# EAGLE design Fyre-BASIC-TOP (EAGLE 9.6.2)
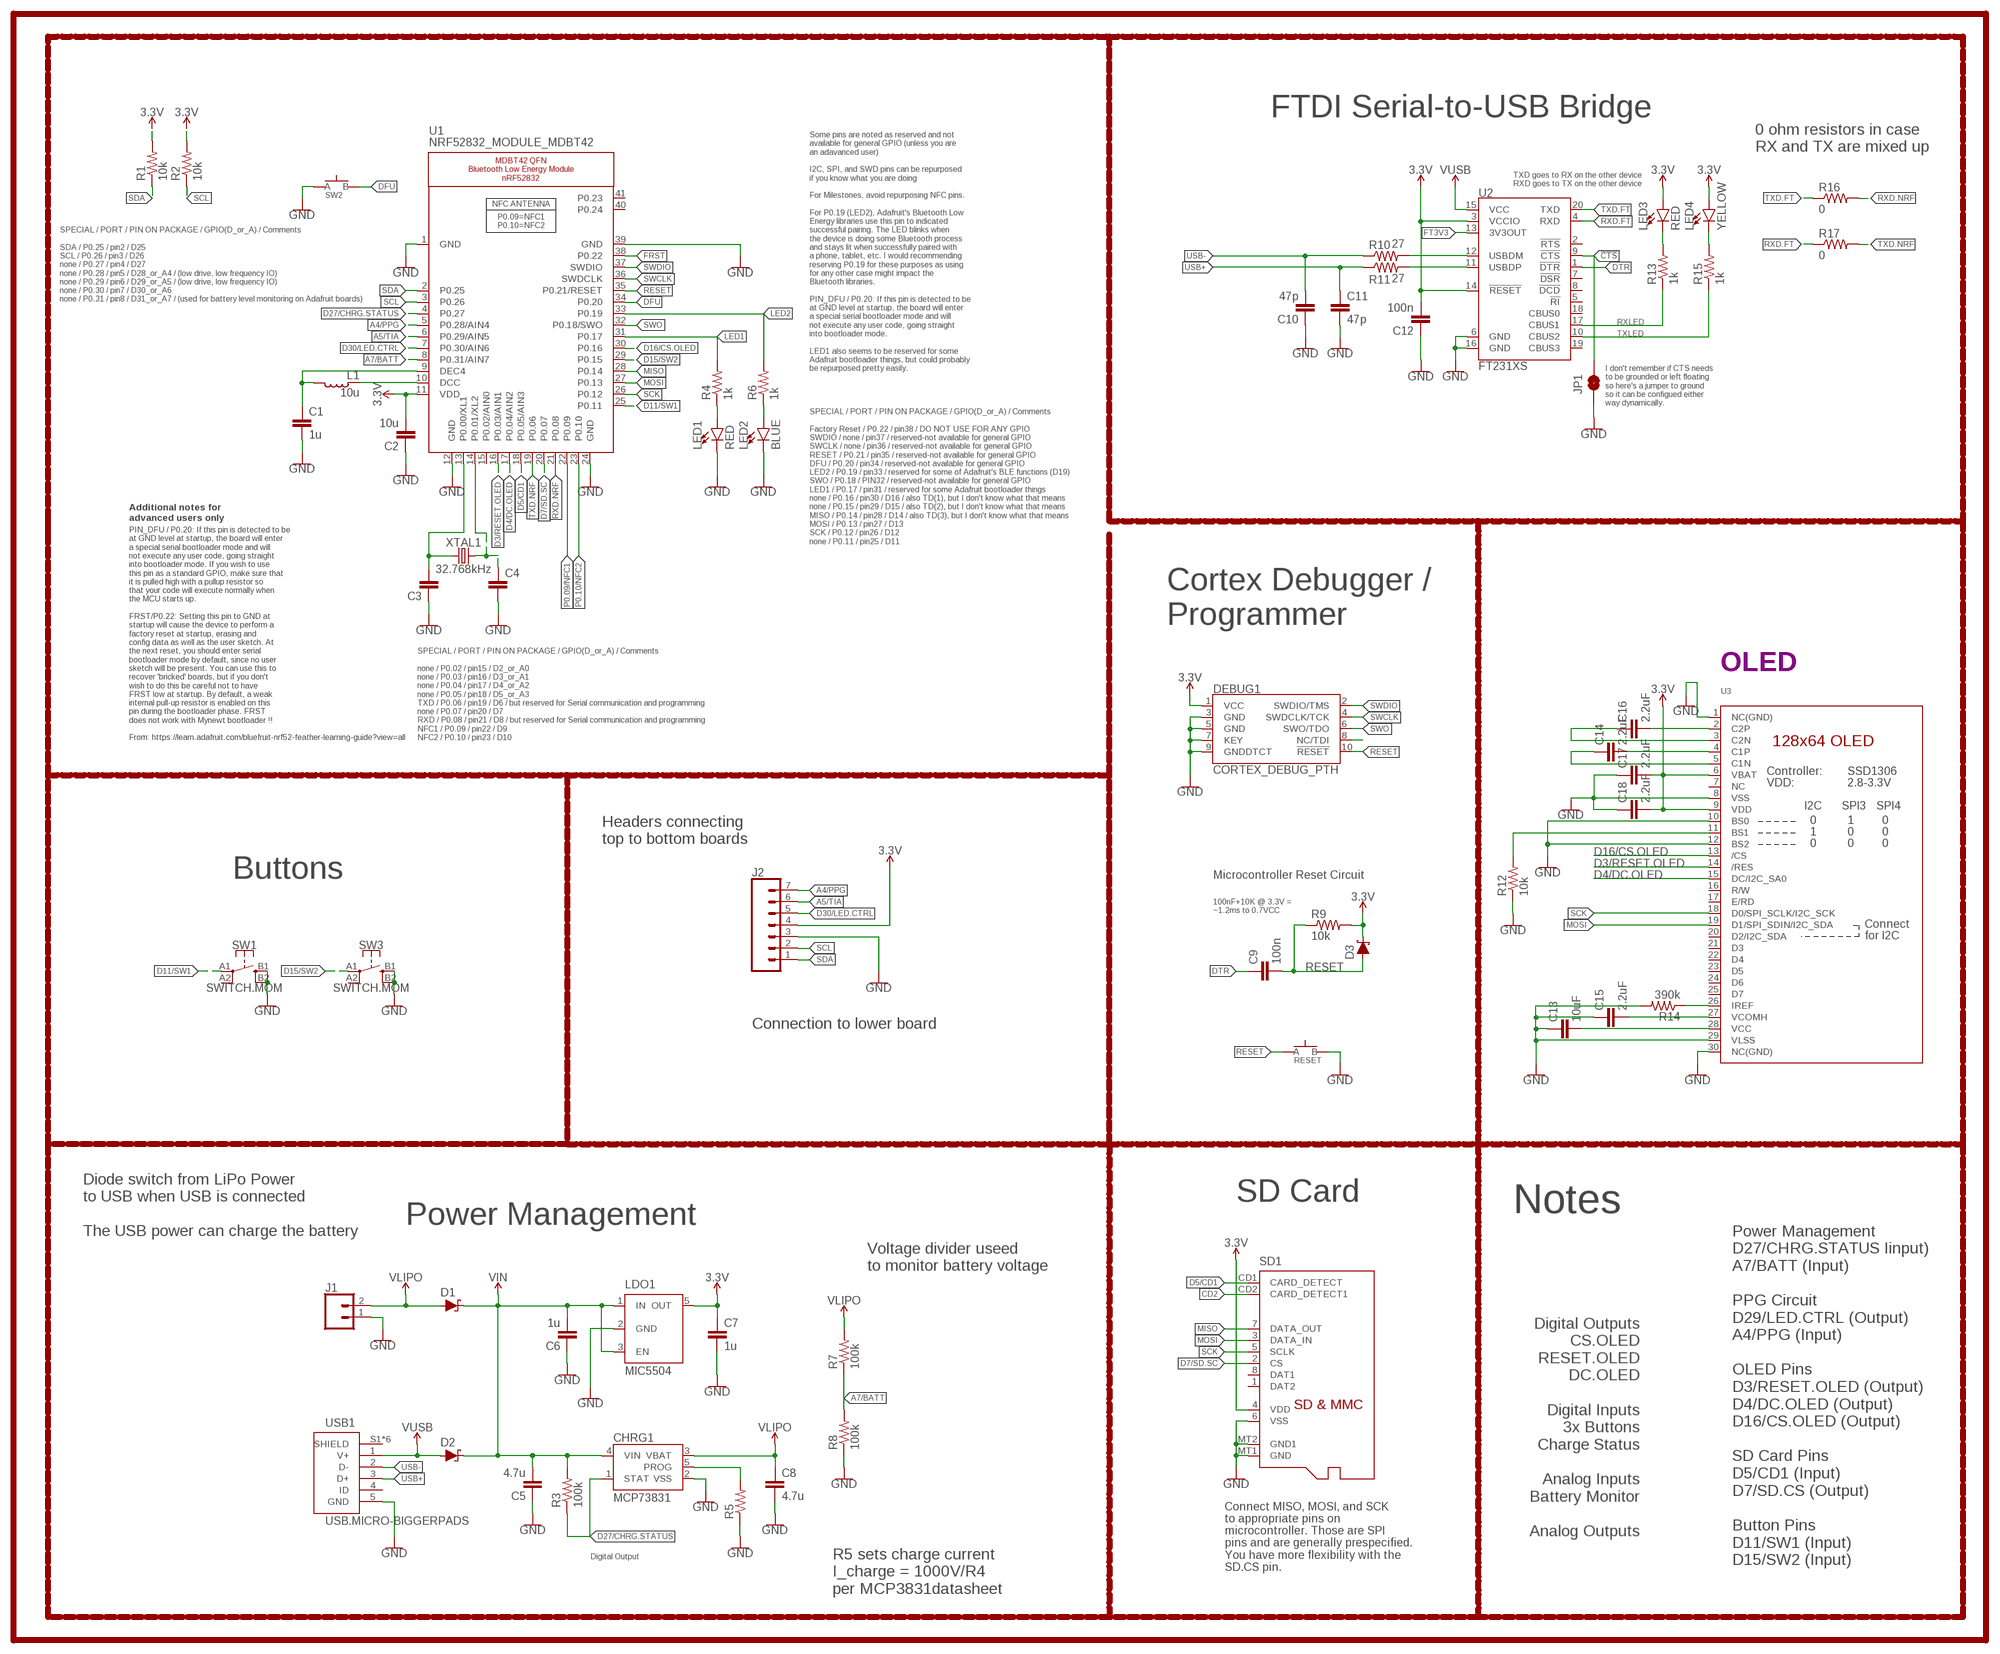
[diagram p0: schematic, sheet 1]

## Parts
C1  1u  CAPACITOR0603  [C0603]
C2  10u  CAPACITOR0805  [C0805]
C3  CAPACITOR0603  [C0603]
C4  CAPACITOR0603  [C0603]
C5  4.7u  CAPACITOR0603  [C0603]
C6  1u  CAPACITOR0603  [C0603]
C7  1u  CAPACITOR0603  [C0603]
C8  4.7u  CAPACITOR0603  [C0603]
C9  100n  CAPACITOR0603  [C0603]
C10  47p  CAPACITOR0603  [C0603]
C11  47p  CAPACITOR0603  [C0603]
C12  100n  CAPACITOR0603  [C0603]
C13  10uF  CAPACITOR0603  [C0603]
C14  2.2uF  CAPACITOR0402  [C0402]
C15  2.2uF  CAPACITOR0402  [C0402]
C16  2.2uF  CAPACITOR0402  [C0402]
C17  2.2uF  CAPACITOR0402  [C0402]
C18  2.2uF  CAPACITOR0402  [C0402]
CHRG1  MCP73831  [SOT23-5]
D1  SCHOTTKY-USC  [USC]
D2  SCHOTTKY-USC  [USC]
D3  SCHOTTKY-USC  [USC]
DEBUG1  CORTEX_DEBUG_PTH  [2X5-PTH-1.27MM]
J1  CONN_02  [1X02]
J2  CONN_07-1.27MM  [1X07_1.27MM]
JP1  JUMPER-SMT_2_NO_SILK  [SMT-JUMPER_2_NO_SILK]
L1  10u  INDUCTOR0603  [L0603]
LDO1  MIC5504  [SOT23-5]
LED1  RED  LED0603  [LED-0603]
LED2  BLUE  LED0603  [LED-0603]
LED3  RED  LED0603  [LED-0603]
LED4  YELLOW  LED0603  [LED-0603]
R1  10k  RESISTOR0603  [R0603]
R2  10k  RESISTOR0603  [R0603]
R3  100k  RESISTOR0603  [R0603]
R4  1k  RESISTOR0603  [R0603]
R5  RESISTOR0603  [R0603]
R6  1k  RESISTOR0603  [R0603]
R7  100k  RESISTOR0603  [R0603]
R8  100k  RESISTOR0603  [R0603]
R9  10k  RESISTOR0603  [R0603]
R10  27  RESISTOR0603  [R0603]
R11  27  RESISTOR0603  [R0603]
R12  10k  RESISTOR0603  [R0603]
R13  1k  RESISTOR0603  [R0603]
R14  390k  RESISTOR0603  [R0603]
R15  1k  RESISTOR0603  [R0603]
R16  0  RESISTOR0603  [R0603]
R17  0  RESISTOR0603  [R0603]
RESET  SPST-PTS830GG140-COPY.1-3  [BUTTON-GULLWING]
SD1  MICROSD  [MICROSD]
SW1  SWITCH.MOM  [TACTILE_SWITCH_SMD_6.2MM_TALL]
SW2  SPST-PTS830GG140-COPY.1-3  [BUTTON-GULLWING]
SW3  SWITCH.MOM  [TACTILE_SWITCH_SMD_6.2MM_TALL]
U1  NRF52832_MODULE_MDBT42  [BLE_MODULE_RAYTAC_MDBT42]
U2  FT231XS  [SSOP20_L]
U3  DISP_OLED_UG-2864HSWEG01-NO-WRAPAROUND  [UG-2864HSWEG01_0.96IN_NO-WRAPAROUND]
USB1  USB.MICRO-BIGGERPADS  [USB-MICRO-01.BIGGERPADS]
XTAL1  32.768kHz  CRYSTALECS-.327-12.5-12-C-TR  [2-SMD.NOLEAD.2.0MMTO1.2MM]

## Nets
3.3V: C2.2 C7.1 C12.2 C17.2 C18.2 D3.-(C) DEBUG1.1(VCC) J2.4 LDO1.5(OUT) LED3.A LED4.A R1.2 R2.2 R9.2 SD1.4(VDD) U1.11(VDD) U2.3(VCCIO) U2.14(!RESET) U3.6(VBAT) U3.9(VDD)
!CTS: JP1.2 U2.9(!CTS)
A4/PPG: J2.7 U1.5(P0.28/AIN4)
A5/TIA: J2.6 U1.6(P0.29/AIN5)
A7/BATT: R7.1 R8.2 U1.8(P0.31/AIN7)
CD2: SD1.CD2(CARD_DETECT1)
D3/RESET.OLED: U1.16(P0.03/AIN1) U3.14(/RES)
D4/DC.OLED: U1.17(P0.04/AIN2) U3.15(DC/I2C_SA0)
D5/CD1: SD1.CD1(CARD_DETECT) U1.18(P0.05/AIN3)
D7/SD.SC: SD1.2(CS) U1.20(P0.07)
D11/SW1: SW1.A1 U1.25(P0.11)
D15/SW2: SW3.A1 U1.29(P0.15)
D16/CS.OLED: U1.30(P0.16) U3.13(/CS)
D27/CHRG.STATUS: CHRG1.1(STAT) R3.1 U1.4(P0.27)
D30/LED.CTRL: J2.5 U1.7(P0.30/AIN6)
DFU: SW2.3(B) U1.34(P0.20)
DTR: C9.1 U2.1(!DTR)
FRST: U1.38(P0.22)
FT3V3: U2.13(3V3OUT)
GND: C1.2 C2.1 C3.1 C4.2 C5.1 C6.1 C7.2 C8.2 C10.1 C11.2 C12.1 C13.1 C15.1 C17.1 C18.1 CHRG1.2(VSS) DEBUG1.3(GND) DEBUG1.5(GND) DEBUG1.7(KEY) DEBUG1.9(GNDDTCT) J1.1 J2.3 JP1.1 LDO1.2(GND) LED1.C LED2.C R5.1 R8.1 R12.1 R14.2 RESET.3(B) SD1.6(VSS) SD1.MT1(GND) SD1.MT2(GND1) SW1.B1 SW1.B2 SW2.1(A) SW3.B1 SW3.B2 U1.1(GND) U1.12(GND) U1.24(GND) U1.39(GND) U2.6(GND) U2.16(GND) U3.1(NC(GND)) U3.8(VSS) U3.10(BS0) U3.12(BS2) U3.29(VLSS) U3.30(NC(GND)) USB1.5(GND)
LED1: R4.2 U1.31(P0.17)
LED2: R6.2 U1.33(P0.19)
MISO: SD1.7(DATA_OUT) U1.28(P0.14)
MOSI: SD1.3(DATA_IN) U1.27(P0.13) U3.19(D1/SPI_SDIN/I2C_SDA)
N$1: R12.2 U3.11(BS1)
N$2: R14.1 U3.26(IREF)
N$3: C16.2 U3.2(C2P)
N$4: C3.2 U1.13(P0.00/XL1) XTAL1.P$1
N$5: C16.1 U3.3(C2N)
N$7: C14.2 U3.4(C1P)
N$8: C14.1 U3.5(C1N)
N$9: LED1.A R4.1
N$10: LED2.A R6.1
N$11: L1.1 U1.10(DCC)
N$12: C1.1 L1.2 U1.9(DEC4)
N$13: C13.2 U3.28(VCC)
N$14: DEBUG1.8(NC/TDI)
N$15: C15.2 U3.27(VCOMH)
N$16: C4.1 U1.14(P0.01/XL2) XTAL1.P$2
N$17: CHRG1.5(PROG) R5.2
N$23: R10.2 U2.12(USBDM)
N$24: R11.2 U2.11(USBDP)
N$25: LED3.C R13.2
N$26: LED4.C R15.2
P0.09/NFC1: U1.22(P0.09)
P0.10/NFC2: U1.23(P0.10)
RESET: C9.2 D3.+(A) DEBUG1.10(!RESET) R9.1 RESET.1(A) U1.35(P0.21/RESET)
RXD.FT: R17.1 U2.4(RXD)
RXD.NRF: R16.2 U1.21(P0.08)
RXLED: R13.1 U2.17(CBUS1)
SCK: SD1.5(SCLK) U1.26(P0.12) U3.18(D0/SPI_SCLK/I2C_SCK)
SCL: J2.2 R2.1 U1.3(P0.26)
SDA: J2.1 R1.1 U1.2(P0.25)
SWCLK: DEBUG1.4(SWDCLK/TCK) U1.36(SWDCLK)
SWDIO: DEBUG1.2(SWDIO/TMS) U1.37(SWDIO)
SWO: DEBUG1.6(SWO/TDO) U1.32(P0.18/SWO)
TXD.FT: R16.1 U2.20(TXD)
TXD.NRF: R17.2 U1.19(P0.06)
TXLED: R15.1 U2.10(CBUS2)
USB+: C11.1 R11.1 USB1.3(D+)
USB-: C10.2 R10.1 USB1.2(D-)
V_USB: D2.+(A) U2.15(VCC) USB1.1(V+) ; supply symbol labelled VUSB
VIN: C5.2 C6.2 CHRG1.4(VIN) D1.-(C) D2.-(C) LDO1.1(IN) LDO1.3(EN) R3.2
VLIPO: C8.1 CHRG1.3(VBAT) D1.+(A) J1.2 R7.2
Unconnected: SD1.1(DAT2) SD1.8(DAT1) SW1.A2 SW3.A2 U1.15(P0.02/AIN0) U1.40(P0.24) U1.41(P0.23) U2.2(!RTS) U2.5(!RI) U2.7(!DSR) U2.8(!DCD) U2.18(CBUS0) U2.19(CBUS3) U3.7(NC) U3.16(R/W) U3.17(E/RD) U3.20(D2/I2C_SDA) U3.21(D3) U3.22(D4) U3.23(D5) U3.24(D6) U3.25(D7) USB1.4(ID) USB1.S1(SHIELD) USB1.S2(SHIELD) USB1.S3(SHIELD) USB1.S4(SHIELD) USB1.S5(SHIELD) USB1.S6(SHIELD)

## Notes on the sheet
- FTDI Serial-to-USB Bridge
- 0 ohm resistors in case
  RX and TX are mixed up
- TXD goes to RX on the other device
  RXD goes to TX on the other device
- SPECIAL / PORT / PIN ON PACKAGE / GPIO(D_or_A) / Comments
  
  SDA / P0.25 / pin2 / D25
  SCL / P0.26 / pin3 / D26
  none / P0.27 / pin4 / D27
  none / P0.28 / pin5 / D28_or_A4 / (low drive, low frequency IO)
  none / P0.29 / pin6 / D29_or_A5 / (low drive, low frequency IO)
  none / P0.30 / pin7 / D30_or_A6
  none / P0.31 / pin8 / D31_or_A7 / (used for battery level monitoring on Adafruit boards)
- Some pins are noted as reserved and not
  available for general GPIO (unless you are
  an adavanced user)
  
  I2C, SPI, and SWD pins can be repurposed
  if you know what you are doing
  
  For Milestones, avoid repurposing NFC pins.
  
  For P0.19 (LED2), Adafruit's Bluetooth Low
  Energy libraries use this pin to indicated
  successful pairing. The LED blinks when
  the device is doing some Bluetooth process
  and stays lit when successfully paired with
  a phone, tablet, etc. I would recommending
  reserving P0.19 for these purposes as using
  for any other case might impact the
  Bluetooth libraries.
  
  PIN_DFU / P0.20: If this pin is detected to be
  at GND level at startup, the board will enter
  a special serial bootloader mode and will
  not execute any user code, going straight
  into bootloader mode.
  
  LED1 also seems to be reserved for some
  Adafruit bootloader things, but could probably
  be repurposed pretty easily.
- I don't remember if CTS needs
  to be grounded or left floating
  so here's a jumper to ground
  so it can be configued either
  way dynamically.
- Additional notes for
  advanced users only
- SPECIAL / PORT / PIN ON PACKAGE / GPIO(D_or_A) / Comments
  
  Factory Reset / P0.22 / pin38 / DO NOT USE FOR ANY GPIO
  SWDIO / none / pin37 / reserved-not available for general GPIO
  SWCLK / none / pin36 / reserved-not available for general GPIO
  RESET / P0.21 / pin35 / reserved-not available for general GPIO
  DFU / P0.20 / pin34 / reserved-not available for general GPIO
  LED2 / P0.19 / pin33 / reserved for some of Adafruit's BLE functions (D19)
  SWO / P0.18 / PIN32 / reserved-not available for general GPIO
  LED1 / P0.17 / pin31 / reserved for some Adafruit bootloader things
  none / P0.16 / pin30 / D16 / also TD(1), but I don't know what that means
  none / P0.15 / pin29 / D15 / also TD(2), but I don't know what that means
  MISO / P0.14 / pin28 / D14 / also TD(3), but I don't know what that means
  MOSI / P0.13 / pin27 / D13
  SCK / P0.12 / pin26 / D12
  none / P0.11 / pin25 / D11
- Cortex Debugger /
  Programmer
- OLED
- PIN_DFU / P0.20: If this pin is detected to be
  at GND level at startup, the board will enter
  a special serial bootloader mode and will
  not execute any user code, going straight
  into bootloader mode. If you wish to use
  this pin as a standard GPIO, make sure that
  it is pulled high with a pullup resistor so
  that your code will execute normally when
  the MCU starts up.
  
  FRST/P0.22: Setting this pin to GND at
  startup will cause the device to perform a
  factory reset at startup, erasing and
  config data as well as the user sketch. At
  the next reset, you should enter serial
  bootloader mode by default, since no user
  sketch will be present. You can use this to
  recover 'bricked' boards, but if you don't
  wish to do this be careful not to have
  FRST low at startup. By default, a weak
  internal pull-up resistor is enabled on this
  pin during the bootloader phase. FRST
  does not work with Mynewt bootloader !!
  
  From: https://learn.adafruit.com/bluefruit-nrf52-feather-learning-guide?view=all
- SPECIAL / PORT / PIN ON PACKAGE / GPIO(D_or_A) / Comments
  
  none / P0.02 / pin15 / D2_or_A0
  none / P0.03 / pin16 / D3_or_A1
  none / P0.04 / pin17 / D4_or_A2
  none / P0.05 / pin18 / D5_or_A3
  TXD / P0.06 / pin19 / D6 / but reserved for Serial communication and programming
  none / P0.07 / pin20 / D7
  RXD / P0.08 / pin21 / D8 / but reserved for Serial communication and programming
  NFC1 / P0.09 / pin22 / D9
  NFC2 / P0.10 / pin23 / D10
- Headers connecting 
  top to bottom boards
- Buttons | Microcontroller Reset Circuit
- 100nF+10K @ 3.3V =
  ~1.2ms to 0.7VCC
- Connection to lower board
- SD Card
- Notes
- Power Management
- Diode switch from LiPo Power
  to USB when USB is connected
  
  The USB power can charge the battery
- Voltage divider useed
  to monitor battery voltage
- Digital Outputs
  CS.OLED
  RESET.OLED
  DC.OLED
  
  Digital Inputs
  3x Buttons
  Charge Status
  
  Analog Inputs
  Battery Monitor
  
  Analog Outputs
- Digital Output
- Connect MISO, MOSI, and SCK
  to appropriate pins on
  microcontroller. Those are SPI
  pins and are generally prespecified.
  You have more flexibility with the
  SD.CS pin.
- Power Management
  D27/CHRG.STATUS Iinput)
  A7/BATT (Input)
  
  PPG Circuit
  D29/LED.CTRL (Output)
  A4/PPG (Input)
  
  OLED Pins
  D3/RESET.OLED (Output)
  D4/DC.OLED (Output)
  D16/CS.OLED (Output)
  
  SD Card Pins
  D5/CD1 (Input)
  D7/SD.CS (Output)
  
  Button Pins
  D11/SW1 (Input)
  D15/SW2 (Input)
- R5 sets charge current
  I_charge = 1000V/R4
  per MCP3831datasheet

## Library data of the parts
C1-C18 = LinnesLab-Passives:CAPACITOR
CHRG1 = LinnesLab-Power:MCP73831: MCP73831T Li-Ion, Li-Pol Controller Miniature single cell, fully integrated Li-Ion, Li-polymer charge management controller Datasheet <http://ww1.microchip.com/downloads/en/DeviceDoc/20001984g.pdf> SparkFun Products: SparkFun ESP32 Thing <https://www.sparkfun.com/products/13907> SparkFun 9DoF Razor IMU M0 <https://www.sparkfun.com/products/14001>; PROD_ID: IC-09995
D1-D3 = LinnesLab-DiscreteSemi:SCHOTTKY: Schottky diode A Schottky diode is a semiconductor diode which has a low forward voltage drop and a very fast switching action. Example: Digi-Key Part Number: RB161MM-20CT-ND
DEBUG1 = LinnesLab-Connectors:CORTEX_DEBUG: Cortex Debug Connector - 10 pin Supports JTAG debug, Serial Wire debug, and Serial Wire Viewer. PTH and SMD connector options available. General Connector Information <http://infocenter.arm.com/help/topic/com.arm.doc.faqs/attached/13634/cortex_debug_connectors.pdf> Products: PTH Connector <http://www.digikey.com/product-detail/en/cnc-tech/3220-10-0100-00/1175-1627-ND/3883661> -via Digi-Key SparkFun PSoc <https://www.sparkfun.com/products/13229> SparkFun T <https://www.sparkfun.com/products/13810>
J1 = LinnesLab-Connectors:CONN_02: Multi connection point. Often used as Generic Header-pin footprint for 0.1 inch spaced/style header connections On any of the 0.1 inch spaced packages, you can populate with these: Break Away Headers - Straight <https://www.sparkfun.com/products/116> (PRT-00116) Break Away Male Headers - Right Angle <https://www.sparkfun.com/products/553> (PRT-00553) Female Headers <https://www.sparkfun.com/products/115> (PRT-00115) Break Away Headers - Machine Pin <https://www.sparkfun.com/products/117> (PRT-00117) Break Away Female Headers - Swiss Machine Pin <https://www.sparkfun.com/products/743> (PRT-00743) For SCREWTERMINALS and SPRING TERMINALS visit here: Screw Terimnals on SparkFun.com <https://www.sparkfun.com/search/results?term=Screw+Terminals> (5mm/3.5mm/2.54mm spacing) This device is also useful as a general connection point to wire up your design to another part of your project. Our various solder wires solder well into these plated through hole pads. Hook-Up Wire - Assortment (Stranded, 22 AWG) <https://www.sparkfun.com/products/11375> (PRT-11375) Hook-Up Wire - Assortment (Solid Core, 22 AWG) <https://www.sparkfun.com/products/11367> (PRT-11367) View the entire wire category on our website here <https://www.sparkfun.com/categories/141> Special notes: Molex polarized connector foot print use with: PRT-08233 with associated crimp pins and housings. 2.54_SCREWTERM for use with PRT-10571. 3.5mm Screw Terminal footprints for PRT-08084 5mm Screw Terminal footprints for use with PRT-08432
J2 = LinnesLab-Connectors:CONN_07: Multi connection point. Often used as Generic Header-pin footprint for 0.1 inch spaced/style header connections On any of the 0.1 inch spaced packages, you can populate with these: Break Away Headers - Straight <https://www.sparkfun.com/products/116> (PRT-00116) Break Away Male Headers - Right Angle <https://www.sparkfun.com/products/553> (PRT-00553) Female Headers <https://www.sparkfun.com/products/115> (PRT-00115) Break Away Headers - Machine Pin <https://www.sparkfun.com/products/117> (PRT-00117) Break Away Female Headers - Swiss Machine Pin <https://www.sparkfun.com/products/743> (PRT-00743) For SCREWTERMINALS and SPRING TERMINALS visit here: Screw Terimnals on SparkFun.com <https://www.sparkfun.com/search/results?term=Screw+Terminals> (5mm/3.5mm/2.54mm spacing) This device is also useful as a general connection point to wire up your design to another part of your project. Our various solder wires solder well into these plated through hole pads. Hook-Up Wire - Assortment (Stranded, 22 AWG) <https://www.sparkfun.com/products/11375> (PRT-11375) Hook-Up Wire - Assortment (Solid Core, 22 AWG) <https://www.sparkfun.com/products/11367> (PRT-11367) View the entire wire category on our website here <https://www.sparkfun.com/categories/141> Special notes: Molex polarized connector foot print use with SKU : PRT-08231 with associated crimp pins and housings. 1MM SMD Version SKU: PRT-10208 NOTES ON THE VARIANTS LOCK and LOCK_LONGPADS... This footprint was designed to help hold the alignment of a through-hole component (i.e. 6-pin header) while soldering it into place. You may notice that each hole has been shifted either up or down by 0.005 of an inch from it's more standard position (which is a perfectly straight line). This slight alteration caused the pins (the squares in the middle) to touch the edges of the holes. Because they are alternating, it causes a "brace" to hold the component in place. 0.005 has proven to be the perfect amount of "off-center" position when using our standard breakaway headers. Although looks a little odd when you look at the bare footprint, once you have a header in there, the alteration is very hard to notice. Also,if you push a header all the way into place, it is covered up entirely on the bottom side.
JP1 = LinnesLab-Switches:JUMPER-SMT_2_NO: Normally open jumper This jumper has two pads in close proximity to each other. Apply solder to close the connection. Round pads are easier to solder for beginners, but are a lot larger. SparkFun Product that uses the round pads: SparkFun EL Sequencer <https://www.sparkfun.com/products/12781>
L1 = LinnesLab-Passives:INDUCTOR
LDO1 = LinnesLab-Power:MIC5504: MIC5504 Voltage Regulator Output Voltages: 1.0V to 3.3V Input Voltages: 2.5V to 5.5V Link to Datasheet http://ww1.microchip.com/downloads/en/DeviceDoc/MIC550X.pdf
LED1-LED4 = LinnesLab-LED:LED: LED (Generic) Standard schematic elements and footprints for 5mm, 3mm, 1206, and 0603 sized LEDs. Generic LEDs with no color specified. LTST-C190KGKT: arrow indicates cathode
R1-R17 = LinnesLab-Passives:RESISTOR
RESET SW2 = LinnesLab-Switches:SPST-PTS830GG140-COPY
SD1 = LinnesLab-Connectors:MICROSD: Micro-SD / Transflash card holder with SPI pinout For the 3M # 2908-05WB-MG and/or 4UCON #19656 push-push type
SW1 SW3 = LinnesLab-Switches:SWITCH.MOM: PTS645SM43SMTR92 LFS
U1 = LinnesLab-Microcontrollers:NRF52832_MODULE_MDBT42: MDBT42 - BLE Module (nRF52832 QFN) VDD: 1.7-3.6V
U2 = LinnesLab-DigitalIC:FT231X: FTDI FT231X Full Speed USB to Full-handshake UART This USB2.0 Full Speed IC offers a compact bridge to full handshake UART interfaces. The device is a UART, capable of operating up to 3MBaud, with low power consumption (8mA). The FT231X includes the complete FT-X series feature set and enables USB to be added into a system design quickly and easily over a UART interface. Datasheet <http://cdn.sparkfun.com/datasheets/Components/General%20IC/DS_FT231X.pdf>; DIGIKEY: 768-1156-5-ND; MFN: FT231XS-U
U3 = LinnesLab-Displays:DISP_OLED_UG-2864HSWEG01: UG-2864HSWEG01 OLED display Both 1.3" and 0.96" models share the same FPC tab footprint, only the screen dimensions vary.
USB1 = LinnesLab-Connectors:USB.MICRO: DigiKey PN: 609-4613-1-ND
XTAL1 = LinnesLab-Clocks:CRYSTAL; DIGIKEY: XC2288CT-ND; FREQ: 32.7680KHZ; LOAD_CAP: 12.5pF

## Board
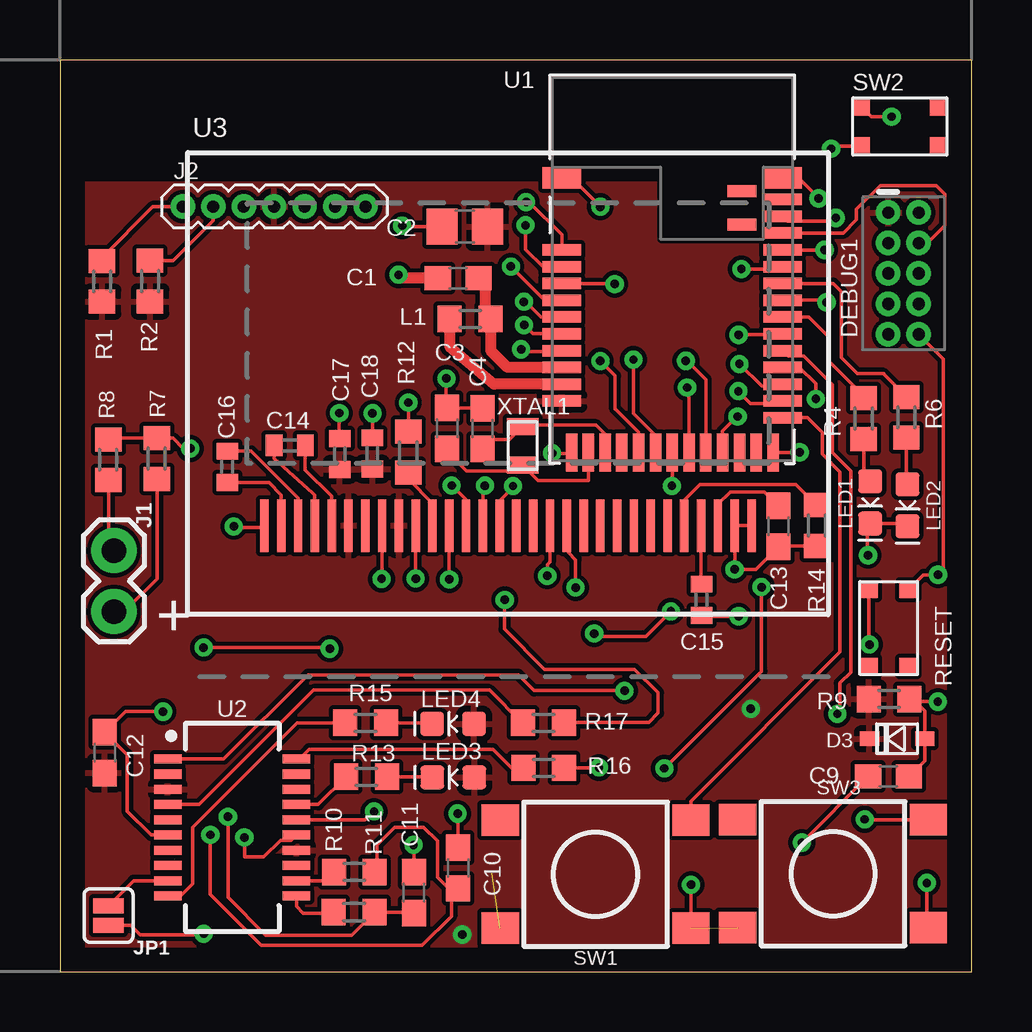
[diagram p1: board, top side]
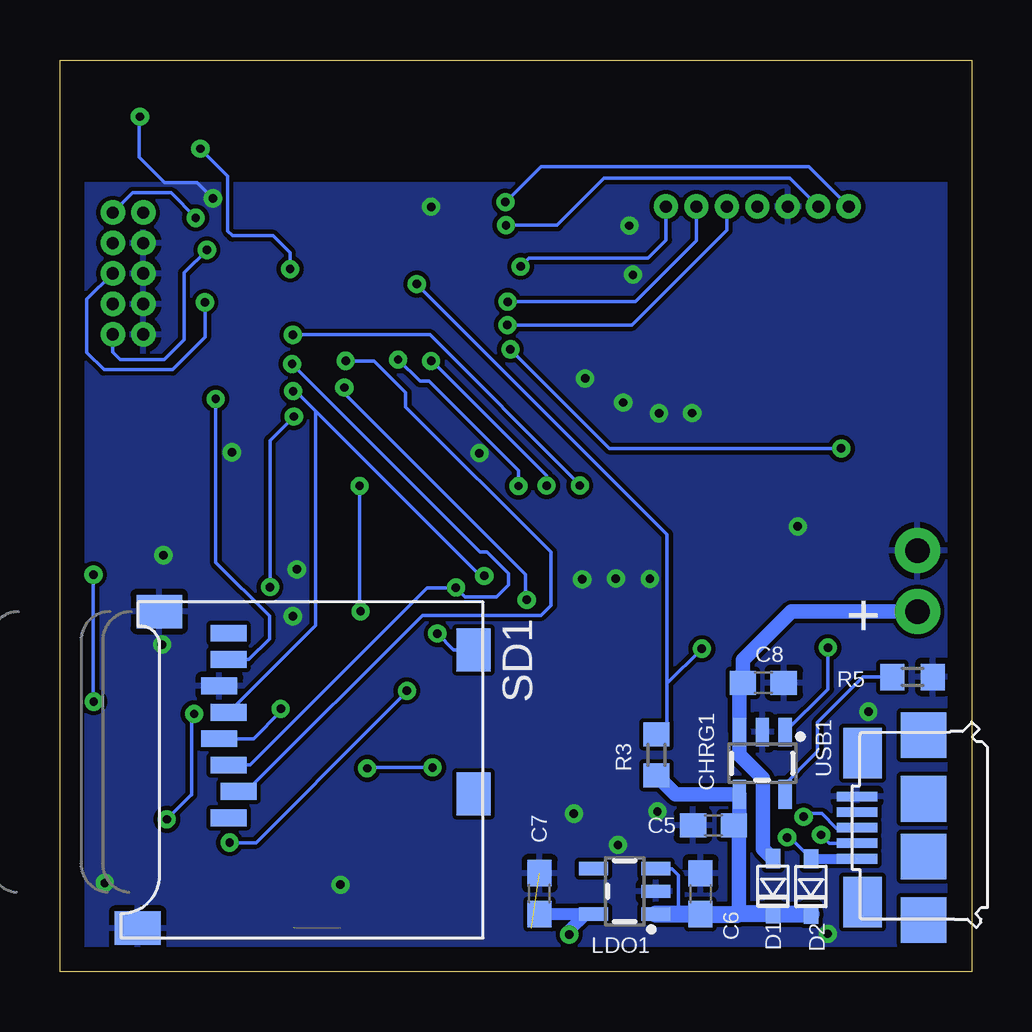
[diagram p2: board, bottom side, seen from below]

Size 38 x 38 mm. Coordinates in mm from the lower left corner, seen from the top.
Outline: 0,0 38,0 38,38 0,38 0,0
Copper layers (1*16): Top 0.035mm / dielectric 1.5mm / Bottom 0.035mm
Design rules "default": minimum track width 6mil, minimum drill 0.35mm, track to track 6mil, track to pad 6mil, pad to pad 6mil, via to via 6mil, smd to smd 6mil, copper to edge 40mil, drill to drill 6mil, minimum pad ring 10mil, minimum via ring 8mil, stop-mask expansion 4mil, vias tented up to drill 0mil, thermal gap 10mil

### Footprints (pad centres in the part's own frame; a part is rotated, then mirrored left to right if it is on the bottom)
C0603 = smd 1.1 x 1: 1 -0.85,0; 2 0.85,0
C0805 = smd 1.3 x 1.5: 1 -0.95,0; 2 0.95,0
C0402 = smd 0.7 x 0.9: 1 -0.65,0; 2 0.65,0
SOT23-5 = smd 0.55 x 1.2: 1 -0.95,-1.3; 2 0,-1.3; 3 0.95,-1.3; 4 0.95,1.3; 5 -0.95,1.3
USC = smd 0.8 x 0.6: + -1.15,0; - 1.15,0
2X5-PTH-1.27MM = drill 0.508 pad 1: 1 -2.54,-0.635; 2 -2.54,0.635; 3 -1.27,-0.635; 4 -1.27,0.635; 5 0,-0.635; 6 0,0.635; 7 1.27,-0.635; 8 1.27,0.635; 9 2.54,-0.635; 10 2.54,0.635
1X02 = drill 1.016 pad 1.88: 1 0,0; 2 2.54,0
1X07_1.27MM = drill 0.508 pad 1: 1 0,0; 2 1.27,0; 3 2.54,0; 4 3.81,0; 5 5.08,0; 6 6.35,0; 7 7.62,0
SMT-JUMPER_2_NO_SILK = smd 0.635 x 1.27: 1 -0.406,0; 2 0.406,0
L0603 = smd 1 x 1.1: 1 -0.85,0; 2 0.85,0
LED-0603 = smd 1 x 1: A -0.877,0; C 0.877,0
R0603 = smd 1 x 1.1: 1 -0.85,0; 2 0.85,0
BUTTON-GULLWING = smd 0.7 x 0.75: 1 -1.6,0.825; 2 1.6,0.825; 3 -1.6,-0.825; 4 1.6,-0.825
MICROSD = smd 0.7 x 1.5: 1 9,-10.64; 2 7.9,-10.24; 3 6.8,-10.64; 4 5.7,-11.04; 5 4.6,-10.64; 6 3.5,-11.04; 7 2.4,-10.64; 8 1.3,-10.64 | smd 1.8 x 1.4: CD1 2,-0.44; CD2 8,-0.44 | smd 1.4 x 1.9: MT1 0.4,-13.54; MT2 13.6,-14.44
TACTILE_SWITCH_SMD_6.2MM_TALL = smd 1.55 x 1.3: A1 -3.975,-2.25; A2 3.975,-2.25; B1 -3.975,2.25; B2 3.975,2.25
BLE_MODULE_RAYTAC_MDBT42 = smd 1.6 x 0.9: 1 -4.6,3.8; 39 4.6,3.8 | smd 1.6 x 0.48: 2 -4.6,0.8; 3 -4.6,0.1; 4 -4.6,-0.6; 5 -4.6,-1.3; 6 -4.6,-2; 7 -4.6,-2.7; 8 -4.6,-3.4; 9 -4.6,-4.1; 10 -4.6,-4.8; 11 -4.6,-5.5; 25 4.6,-6.2; 26 4.6,-5.5; 27 4.6,-4.8; 28 4.6,-4.1; 29 4.6,-3.4; 30 4.6,-2.7; 31 4.6,-2; 32 4.6,-1.3; 33 4.6,-0.6; 34 4.6,0.1; 35 4.6,0.8; 36 4.6,1.5; 37 4.6,2.2; 38 4.6,2.9 | smd 0.48 x 1.6: 12 -4.2,-7.65; 13 -3.5,-7.65; 14 -2.8,-7.65; 15 -2.1,-7.65; 16 -1.4,-7.65; 17 -0.7,-7.65; 18 0,-7.65; 19 0.7,-7.65; 20 1.4,-7.65; 21 2.1,-7.65; 22 2.8,-7.65; 23 3.5,-7.65; 24 4.2,-7.65 | smd 1.2 x 0.5: 40 2.9,3.25; 41 2.9,1.85
SSOP20_L = smd 0.381 x 1.143: 1 -2.857,-2.68; 2 -2.223,-2.68; 3 -1.587,-2.68; 4 -0.953,-2.68; 5 -0.318,-2.68; 6 0.318,-2.68; 7 0.953,-2.68; 8 1.587,-2.68; 9 2.223,-2.68; 10 2.857,-2.68; 11 2.857,2.68; 12 2.223,2.68; 13 1.587,2.68; 14 0.953,2.68; 15 0.318,2.68; 16 -0.318,2.68; 17 -0.953,2.68; 18 -1.587,2.68; 19 -2.223,2.68; 20 -2.857,2.68
UG-2864HSWEG01_0.96IN_NO-WRAPAROUND = smd 0.35 x 2.2: 1 -10.15,-1.2; 2 -9.45,-1.2; 3 -8.75,-1.2; 4 -8.05,-1.2; 5 -7.35,-1.2; 6 -6.65,-1.2; 7 -5.95,-1.2; 8 -5.25,-1.2; 9 -4.55,-1.2; 10 -3.85,-1.2; 11 -3.15,-1.2; 12 -2.45,-1.2; 13 -1.75,-1.2; 14 -1.05,-1.2; 15 -0.35,-1.2; 16 0.35,-1.2; 17 1.05,-1.2; 18 1.75,-1.2; 19 2.45,-1.2; 20 3.15,-1.2; 21 3.85,-1.2; 22 4.55,-1.2; 23 5.25,-1.2; 24 5.95,-1.2; 25 6.65,-1.2; 26 7.35,-1.2; 27 8.05,-1.2; 28 8.75,-1.2; 29 9.45,-1.2; 30 10.15,-1.2
USB-MICRO-01.BIGGERPADS = smd 0.4 x 1.7: 1 -1.3,1.505; 2 -0.65,1.505; 3 0,1.505; 4 0.65,1.505; 5 1.3,1.505 | smd 1.9 x 1.9: S1 -3.85,-1.27; S2 -1.2,-1.27; S3 1.2,-1.27; S4 3.85,-1.27 | smd 2.1 x 1.6: S5 -3.1,1.28; S6 3.1,1.28
2-SMD.NOLEAD.2.0MMTO1.2MM = smd 0.7 x 1.3: P$1 -0.8,0; P$2 0.8,0

### Placement (x,y rotation side)
C1  16.6,28.91 180 top
C2  16.87,31.05 0 top
C3  16.14,22.64 270 top
C4  17.62,22.63 90 top
C5  10.76,6.09 0 bottom
C6  11.3,3.24 270 bottom
C7  18.01,3.25 90 bottom
C8  8.68,12.04 0 bottom
C9  34.53,8.13 0 top
C10  16.6,4.32 270 top
C11  14.76,3.29 90 top
C12  1.87,9.12 270 top
C13  29.95,18.56 90 top
C14  9.58,21.93 180 top
C15  26.74,15.5 90 top
C16  6.97,21.04 270 top
C17  11.67,21.57 270 top
C18  13.02,21.6 270 top
CHRG1  8.72,8.68 180 bottom
D1  8.28,3.56 270 bottom
D2  6.69,3.54 270 bottom
D3  34.9,9.7 180 top
DEBUG1  35.16,29.1 270 top
J1  2.25,17.55 270 top
J2  5.12,31.89 0 top
JP1  2.03,2.34 90 top
L1  17.1,27.21 0 top
LDO1  14.46,3.35 90 bottom
LED1  33.78,19.56 270 top
LED2  35.33,19.44 270 top
LED3  16.4,8.09 180 top
LED4  16.39,10.33 180 top
R1  1.75,28.77 270 top
R2  3.76,28.78 270 top
R3  13.13,9.03 270 bottom
R4  33.5,23.05 90 top
R5  2.46,12.27 180 bottom
R6  35.28,23.1 90 top
R7  4.03,21.38 270 top
R8  2.01,21.33 90 top
R9  34.56,11.36 180 top
R10  12.27,4.15 180 top
R11  12.26,2.48 180 top
R12  14.52,21.65 270 top
R13  12.78,8.12 0 top
R14  31.56,18.59 270 top
R15  12.74,10.37 0 top
R16  20.17,8.49 0 top
R17  20.16,10.37 0 top
RESET  34.55,14.32 270 top
SD1  20.32,15.41 270 bottom
SW1  22.33,4.06 180 top
SW2  35.01,35.23 0 top
SW3  32.23,4.08 180 top
U1  25.52,29.28 0 top
U2  7.18,6.01 270 top
U3  18.68,19.78 0 top
USB1  3.27,6 90 bottom
XTAL1  19.29,21.92 90 top

### Tracks (layer width: path | path; a pad name or v marks a point on that pad's centre or on a via)
3.3V  (via drill 0.35)
  Bottom 0.152: SD1.4 29.93,9.71 28.8,10.84 v28.8,10.96
  Bottom 0.508: C7.1 LDO1.5 15.77,2.38 16.1,2.38 16.77,1.72 v16.77,1.54
  pour Top (isolate 0.178): 37.81,32.87 37.81,0.74 37.33,0.27 0.44,0.27 0.44,32.87
!CTS
  Top 0.152: U2.9 3.07,3.79 JP1.2
A4/PPG  (via drill 0.35)
  Top 0.152: U1.5 20.2,27.98 v18.8,29.39
  Bottom 0.152: v18.8,29.39 18.45,29.74 13.5,29.74 12.74,30.49 J2.7
A5/TIA  (via drill 0.35)
  Top 0.152: U1.6 20.05,27.28 19.41,27.93 v19.34,27.93
  Bottom 0.152: v19.34,27.93 14.02,27.93 11.47,30.47 J2.6
A7/BATT  (via drill 0.35)
  Top 0.152: R8.2 2.06,22.23 R7.1 4.72,22.23 5.14,21.81 v5.43,21.81 | U1.8 20.89,25.85 19.3,25.85 19.23,25.93 v19.23,25.94
  Bottom 0.152: v19.23,25.94 15.09,21.81 v5.43,21.81
D3/RESET.OLED  (via drill 0.35)
  Top 0.152: U3.14 17.63,20.17 17.62,20.18 v17.7,20.25 v17.71,20.25 | U1.16 24.11,21.65 24.11,22.5 23.16,23.45 23.14,23.45 23.14,24.84 v22.53,25.45
  Bottom 0.152: v17.71,20.25 17.71,20.68 22.49,25.45 v22.53,25.45
D4/DC.OLED  (via drill 0.35)
  Top 0.152: U3.15 18.33,19.61 18.89,20.17 v18.89,20.24 | v23.91,25.51 23.91,23.27 24.85,22.32 24.85,21.66 U1.17
  Bottom 0.152: v18.89,20.24 18.89,20.88 22.62,24.61 23,24.61 v23.91,25.51
D5/CD1  (via drill 0.35)
  Top 0.152: v25.51,20.25 25.52,20.26 U1.18 | v22.27,14.09 22.3,14.09 22.41,13.97 24.43,13.97 v25.47,15.02
  Bottom 0.152: v25.51,20.25 25.51,15.06 v25.47,15.02 | SD1.CD1 21.59,13.4 v22.27,14.09
D7/SD.SC  (via drill 0.35)
  Top 0.152: U1.20 26.92,24.68 26.15,25.46 v26.09,25.46
  Bottom 0.152: SD1.2 30.23,7.5 22.9,14.84 17.95,14.84 17.53,15.27 17.53,17.48 23.58,23.54 23.58,24.13 24.91,25.46 v26.09,25.46
D11/SW1
  Top 0.152: SW1.A1 26.3,7.1 32.52,13.31 32.52,20.83 31.77,21.57 31.77,22.47 31.16,23.08 U1.25
D15/SW2  (via drill 0.35)
  Top 0.152: U1.29 30.36,25.65 31.02,25.65 32.19,24.48 32.19,21.64 32.96,20.87 32.96,12.48 32.51,12.02 32.51,10.74 v32.41,10.74 | SW3.A1 33.56,6.33 v33.55,6.34
  Bottom 0.152: v33.55,6.34 32.52,7.37 32.51,7.37 32.51,10.63 v32.41,10.74
D16/CS.OLED  (via drill 0.35)
  Top 0.152: v16.33,20.26 16.9,19.69 16.9,18.61 U3.13 | U1.30 30.08,26.54 v28.29,26.54
  Bottom 0.152: v16.33,20.26 16.54,20.47 16.54,20.5 22.58,26.54 v28.29,26.54
D27/CHRG.STATUS  (via drill 0.35)
  Top 0.152: U1.4 23.12,28.68 23.13,28.68 v23.13,28.66 | v5.99,13.51 11.19,13.51 v11.24,13.46
  Bottom 0.152: v23.13,28.66 12.69,18.22 12.69,12.01 | R3.1 12.69,10.32 12.69,12.01 | CHRG1.1 5.99,11.77 v5.99,13.51 | v11.24,13.46 12.69,12.01
D30/LED.CTRL  (via drill 0.35)
  Top 0.152: U1.7 19.72,26.58 v19.35,26.95
  Bottom 0.152: v19.35,26.95 14.15,26.95 10.2,30.9 J2.5
DFU  (via drill 0.35)
  Top 0.152: U1.34 30.03,29.29 v28.41,29.29 | v32.15,34.3 32.25,34.41 SW2.3
  Bottom 0.152: v28.41,29.29 28.41,29.97 29.11,30.67 30.81,30.67 31.01,30.87 31.01,33.16 v32.15,34.3
DTR  (via drill 0.35)
  Top 0.152: C9.1 v30.93,5.38 | U2.1 6.83,8.87 10.34,12.38 19.11,12.38 19.76,11.72 23.52,11.72 v23.54,11.7
  Bottom 0.152: v30.93,5.38 30.8,5.38 29.83,5.38 24.79,10.41 23.49,11.71 23.52,11.71 v23.54,11.7
GND  (via drill 0.35)  (2 unrouted)
  Top 0.152: v7.25,18.56 7.3,18.5 8.53,18.5 U3.1 | C17.1 11.64,22.23 v11.64,23.28 | v13.03,23.27 13.03,22.62 13.02,22.61 C18.1 | U3.8 13.43,16.39 v13.41,16.37 | v14.52,23.72 R12.1 | U3.30 U3.29 28.13,16.98 v28.13,16.77 | v28.29,14.81 26.78,14.81 C15.1 | U3.10 v14.83,16.38 | U3.12 v16.23,16.35 | C11.2 14.76,5.22 14.76,5.28 v14.74,5.28 | C10.1 16.6,6.56 v16.58,6.58 | R8.1 2.03,20.47 2.03,17.77 J1.1 | C4.2 17.61,23.49 C3.1 16.09,23.54 16.09,24.71 v16.11,24.72 | U1.12 21.28,21.59 20.54,21.59 v20.51,21.61 | v28.13,16.77 v28.12,16.76 | R14.2 29.98,17.74 C13.1 29.01,16.77 v28.13,16.77 | v30.84,21.65 30.82,21.63 U1.24 | LED2.C 35.21,18.68 LED1.C 33.66,18.57 33.66,17.36 v33.69,17.36 | v34.67,35.63 33.83,35.63 SW2.1 | 36.16,1.87 SW3.B1 36.14,1.9 v36.14,3.7 | SW1.B1 26.3,3.39 26.19,3.5 v26.31,3.62 | C2.1 14.36,31.05 14.29,31.11 v14.27,31.09 | U1.1 21.32,33.08 v22.52,31.88 | U2.16 12.72,6.33 13.07,6.67 v13.09,6.67 | JP1.1 2.95,1.93 3.35,1.54 5.99,1.54 v5.99,1.57 | U1.39 30.77,33.08 v31.63,32.23 | RESET.3 33.72,13.63 33.73,13.62 v33.75,13.63 | v4.3,10.84 2.74,10.84 C12.1 2.81,9.04 2.81,6.68 3.79,5.69 U2.6
  Top 0.457: v14.12,29.05 14.25,28.91 C1.2
  Bottom 0.152: v34.67,35.63 34.7,35.6 34.7,33.94 33.64,32.88 32.28,32.88 v31.63,32.23
  pour Bottom (isolate 0.178): 0.3,32.85 0.3,0.36 0.52,0.14 37.45,0.14 37.82,0.51 37.82,32.85
LED1
  Top 0.152: R4.2 33.5,24 32.01,25.49 32.01,26.49 31.22,27.28 U1.31
LED2
  Top 0.152: U1.33 32.23,28.68 32.58,28.34 32.58,25.59 33.25,24.92 34.34,24.92 34.34,24.9 R6.2
MISO  (via drill 0.35)
  Top 0.152: U1.28 30.83,25.18 31.51,24.5 v31.51,23.87
  Bottom 0.152: v31.51,23.87 31.51,17.06 29.26,14.82 29.26,13.87 30.13,13.01 SD1.7
MOSI  (via drill 0.35)
  Top 0.152: U3.19 21.2,18.51 21.2,17.46 21.5,17.16 v21.5,16 | v28.32,25.33 29.26,24.4 30.04,24.4 U1.27
  Bottom 0.152: v28.32,25.33 20.48,17.48 20.19,17.48 19.3,16.59 19.3,16.12 19.8,15.61 21.11,15.61 v21.5,16 21.51,15.99 22.7,15.99 30.08,8.61 SD1.3
N$1
  Top 0.152: U3.11 15.53,19.52 14.52,20.52 R12.2
N$2
  Top 0.152: U3.26 26,18.56 25.99,18.57 25.99,19.62 26.68,20.31 30.68,20.31 R14.1
N$3
  Top 0.152: C16.2 6.99,20.38 8.71,20.38 9.23,19.86 U3.2
N$4
  Top 0.152: U1.13 22.02,20.48 19.93,20.48 XTAL1.P$1 19.04,20.87 16.95,20.87 16.19,21.63 16.19,21.74 C3.2
N$5
  Top 0.152: U3.3 9.93,19.74 7.97,21.69 C16.1
N$7
  Top 0.152: U3.4 10.62,18.59 10.62,19.86 10.53,19.94 8.93,21.39 C14.2
N$8
  Top 0.152: C14.1 10.23,20.91 11.33,19.82 U3.5
N$9
  Top 0.152: LED1.A 33.5,20.71 R4.1
N$10
  Top 0.152: LED2.A 35.28,20.36 R6.1
N$11
  Top 0.457: U1.10 18.1,24.48 16.25,26.06 L1.1
N$12
  Top 0.457: U1.9 18.66,25.18 17.95,25.89 L1.2 17.72,27.43 17.72,28.64 C1.1
N$13
  Top 0.152: C13.2 29.37,20 27.94,20 27.43,19.48 U3.28
N$15
  Top 0.152: U3.27 26.73,19.56 U3.27 | U3.27 26.73,16.16 C15.2
N$16
  Top 0.152: C4.1 18.01,22.18 18.75,22.18 XTAL1.P$2 19.35,22.78 22.35,22.78 22.76,22.37 | U1.14 22.72,22.34 22.76,22.37 | 22.76,22.37
N$17
  Bottom 0.152: R5.2 4.53,12.27 6.42,10.38 6.42,9.17 7.99,7.6 CHRG1.5
N$23
  Top 0.152: R10.2 11.06,3.79 U2.12
N$24
  Top 0.152: R11.2 11.37,2.43 10.14,2.43 9.86,2.72 U2.11
N$25
  Top 0.152: R13.2 15.49,8.12 LED3.C
N$26
  Top 0.152: LED4.C 15.56,10.37 R15.2
RESET  (via drill 0.35)
  Top 0.152: DEBUG1.10 36.82,25.54 36.82,16.54 v36.61,16.54 35.99,16.54 RESET.1 | R9.1 35.5,11.28 35.63,11.28 35.65,11.26 | 35.65,11.26 36.05,10.86 D3.+ 36.05,8.79 C9.2 | v31.87,30.08 U1.35 | v36.59,11.25 36.58,11.26 35.65,11.26
  Bottom 0.152: DEBUG1.10 35.8,25.82 35.5,25.51 33.66,25.51 32.83,26.35 32.83,29.13 v31.87,30.08 | v36.61,16.54 36.61,11.3 36.57,11.27 v36.59,11.25
RXD.FT
  Top 0.152: R17.1 19.26,10.37 17.9,11.73 10.57,11.73 5.8,6.96 U2.4
RXD.NRF  (via drill 0.35)
  Top 0.152: U1.21 27.62,22.53 28.23,23.14 v28.25,23.14 | v25.19,8.47 29.25,12.52 v29.25,16.03 | R16.2 22.48,8.49 | 22.48,8.49 | 22.48,8.49 v22.47,8.5
  Bottom 0.152: v29.25,16.03 29.25,22.14 v28.25,23.14 | v22.47,8.5 25.16,8.5 v25.19,8.47
RXLED
  Top 0.152: R13.1 10.77,6.96 U2.17
SCK  (via drill 0.35)
  Top 0.152: U3.18 20.43,17.08 20.32,16.96 v20.32,16.5 | v28.28,24.19 28.79,23.69 30.03,23.69 U1.26
  Bottom 0.152: v20.32,16.5 20.48,16.5 27.31,23.33 | v28.28,24.19 28.17,24.19 27.31,23.33 | SD1.5 27.34,14.43 27.34,23.3 27.31,23.33
SCL  (via drill 0.35)
  Top 0.152: U1.3 20.13,29.38 19.41,30.1 v19.41,31.11 | R2.1 4.71,29.63 6.39,31.31 J2.2
  Bottom 0.152: v19.41,31.11 17.27,31.11 15.32,33.06 7.56,33.06 J2.2
SDA  (via drill 0.35)
  Top 0.152: U1.2 20.92,30.71 19.56,32.08 v19.43,32.08 | J2.1 5.11,31.88 3.87,31.88 1.75,29.76 R1.1
  Bottom 0.152: v19.43,32.08 17.95,33.56 6.79,33.56 J2.1
SWCLK
  Top 0.152: U1.36 32.65,30.78 33.21,31.34 33.21,31.77 34.19,32.76 36.53,32.76 36.89,32.4 36.89,31.1 36.15,30.37 DEBUG1.4
SWDIO  (via drill 0.35)
  Top 0.152: v32.34,31.41 32.22,31.29 30.32,31.29 U1.37
  Bottom 0.152: v32.34,31.41 32.34,31.43 33.37,32.46 34.98,32.46 DEBUG1.2
SWO  (via drill 0.35)
  Top 0.152: U1.32 31.96,27.98 v31.96,27.9
  Bottom 0.152: v31.96,27.9 31.96,27.87 31.96,27.86 31.96,26.44 33.31,25.09 36.16,25.09 36.88,25.81 36.88,28.02 DEBUG1.6
TXD.FT
  Top 0.152: R16.1 18.83,8.49 18.05,9.26 10.38,9.26 9.98,8.87 U2.20
TXD.NRF  (via drill 0.35)
  Top 0.152: U1.19 26.22,24.37 26.17,24.37 v26.14,24.34 | R17.2 21.03,10.39 24.55,10.39 24.93,10.78 24.93,11.63 23.96,12.6 20.2,12.6 18.53,14.28 18.53,15.49 v18.54,15.5
  Bottom 0.152: v26.14,24.34 26.14,24.1 18.59,16.54 18.59,15.54 v18.54,15.5
TXLED
  Top 0.152: R15.1 9.88,10.37 5.52,6.01 5.52,3.66 5.01,3.14 4.51,3.14 U2.10
USB+  (via drill 0.35)
  Top 0.152: C11.1 14.72,2.48 R11.1 12.15,1.52 8.57,1.52 7,3.09 v7,6.45
  Bottom 0.152: USB1.3 4.79,5.98 5.63,5.98 6.25,6.59 6.87,6.59 v7,6.45
USB-  (via drill 0.35)
  Top 0.152: R10.1 13.21,4.24 13.21,5.28 13.95,6.01 15.16,6.01 15.73,5.44 15.73,3.93 16.19,3.47 C10.2 | C10.2 16.31,3.18 16.31,2.31 15.1,1.09 8.39,1.09 6.27,3.22 v6.27,5.7 | C10.2 16.77,3.64
  Bottom 0.152: v6.27,5.7 5.92,5.35 USB1.2
V_USB  (via drill 0.35)  (1 unrouted)
  Top 0.152: U2.15 9.64,5.48 9.19,5.48 8.5,4.79 7.69,4.79 v7.69,5.59
  Bottom 0.152: v7.69,5.59 7.57,5.59 6.69,4.71 D2.+
  Bottom 0.406: D2.+ 6.68,4.7 USB1.1
VIN
  Bottom 0.152: LDO1.3 13.14,4.28 12.49,4.28 12.23,4.02 12.23,2.39
  Bottom 0.61: 9.67,2.43 9.7,2.4 9.71,2.39 9.71,6.29 | 9.71,6.29 C5.2 | 9.71,6.29 9.71,6.41 9.67,6.44 CHRG1.4 12.33,7.38 R3.2
  Bottom 0.711: D2.- 8.26,2.39 8.27,2.4 | 8.27,2.4 D1.- | 9.71,2.39 C6.2 12.23,2.39 | 8.27,2.4 9.7,2.4 | 12.23,2.39 13.15,2.39 LDO1.1
VLIPO
  Top 0.152: R7.2 4.05,20.51 4.05,16.37 2.69,15.01 J1.2
  Bottom 0.61: D1.+ 8.69,5.12 8.69,8.05 9.67,9.03 CHRG1.3 9.67,11.89 C8.1 9.53,12.99 7.51,15.01 J1.2

### Text on the board
tNames: +
bNames: +